# Altium project iot_watch.PrjPcb
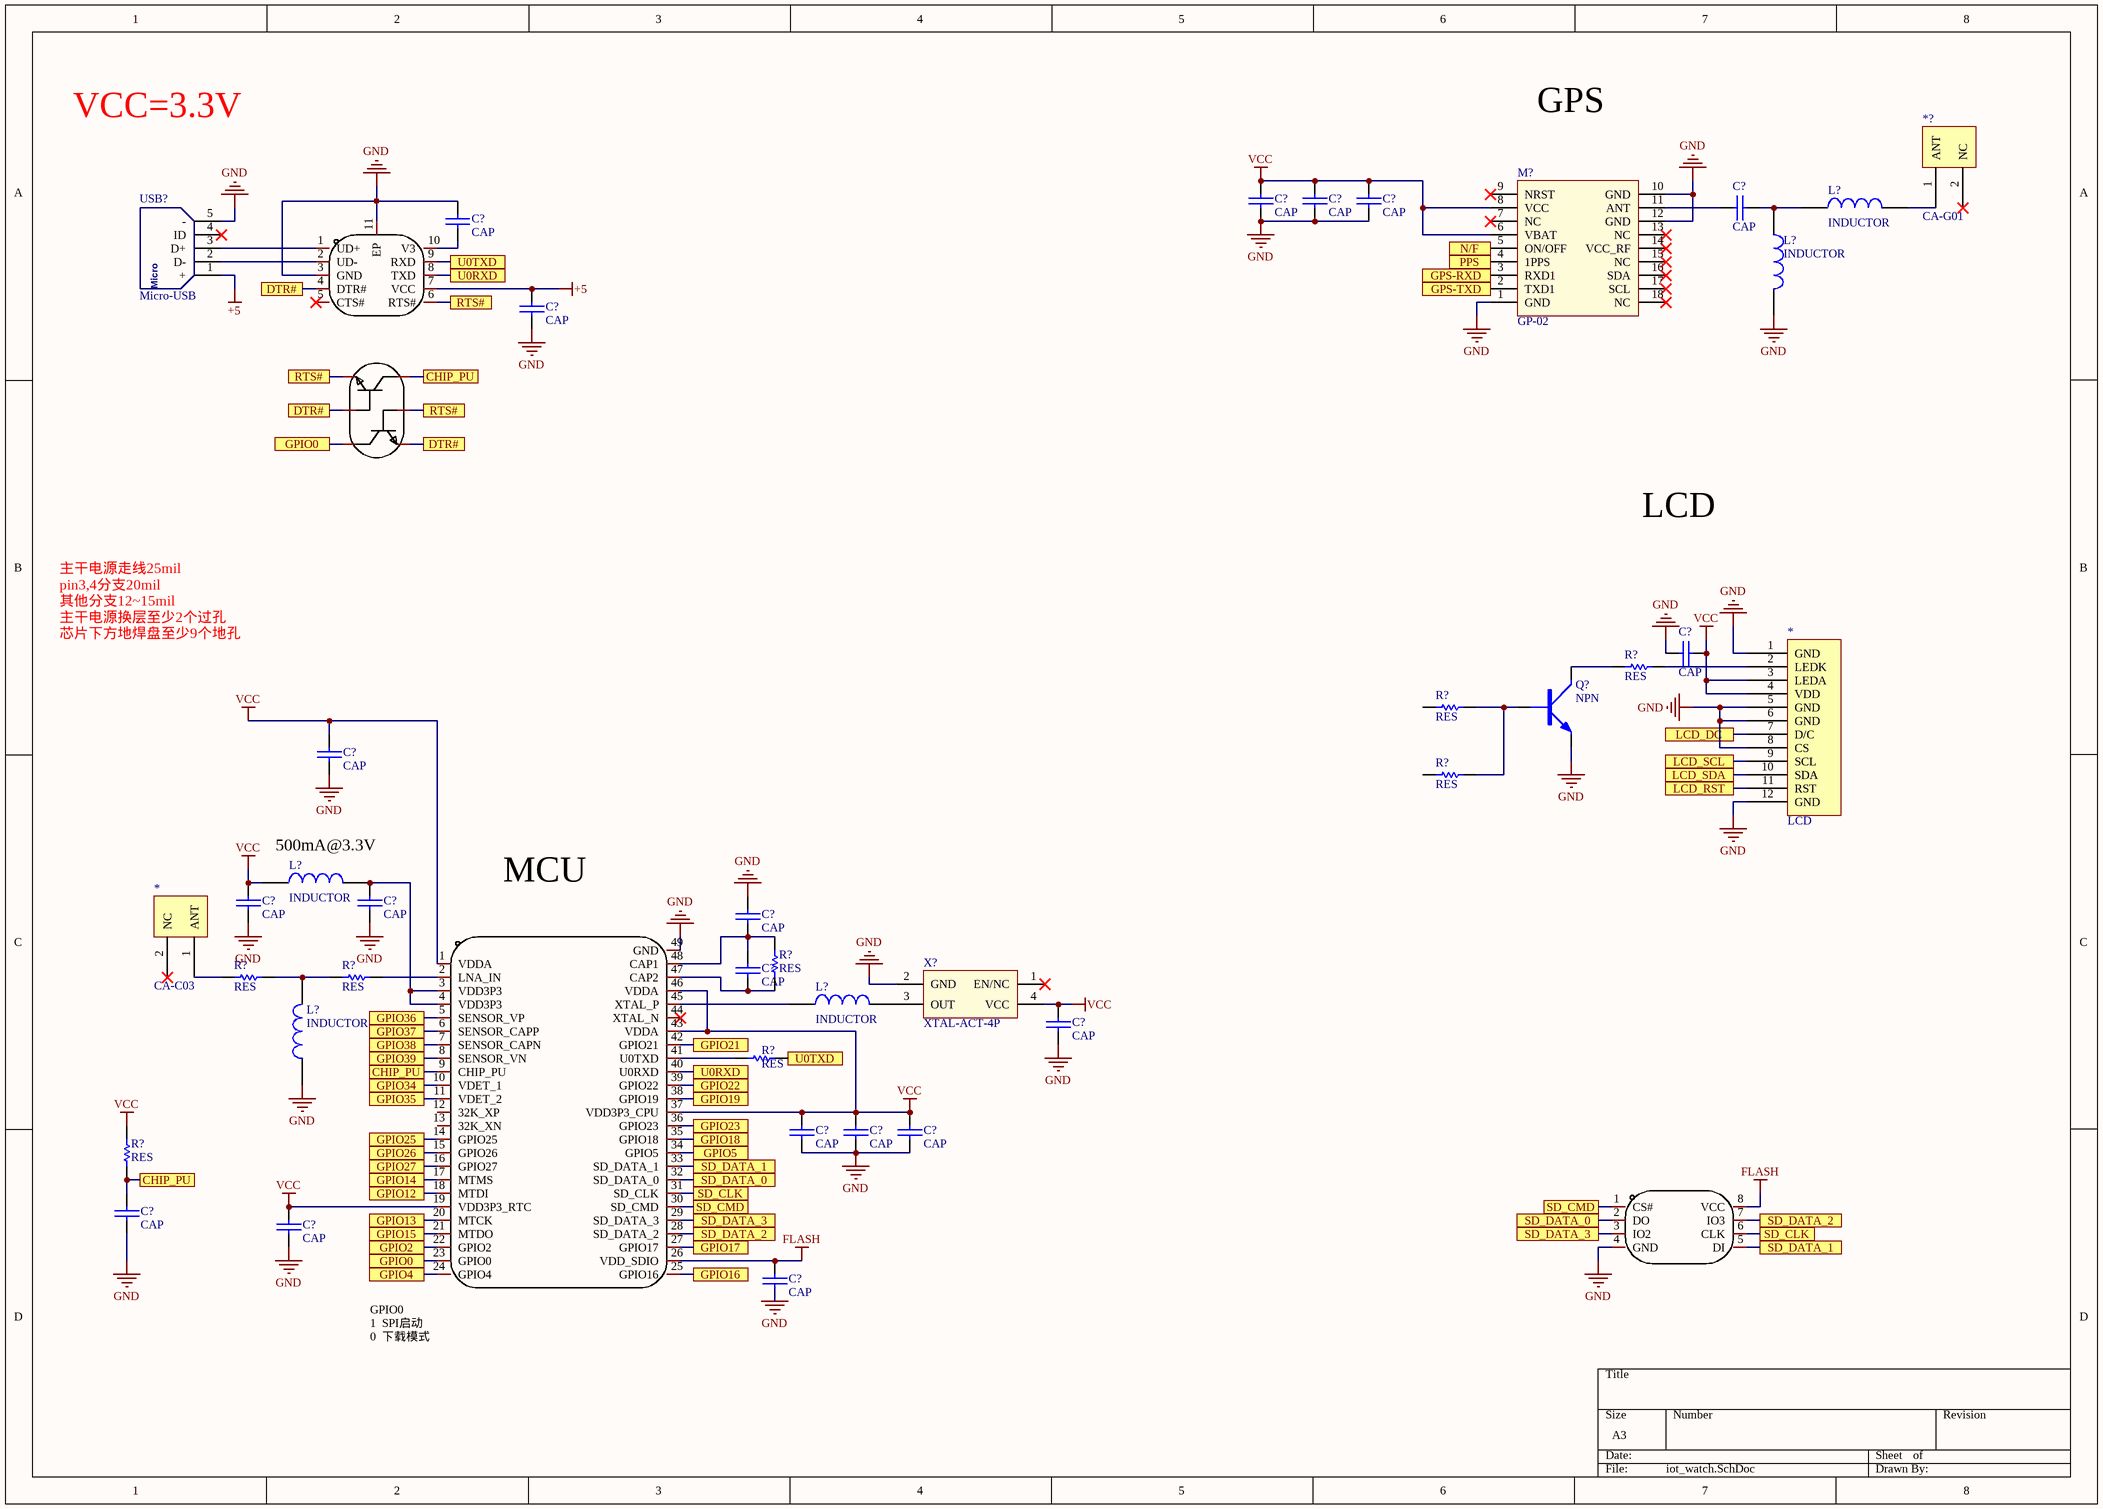
[diagram p0: iot_watch.SchDoc]
1 sheet, 43 parts. Net scope: flat (ports and power ports of the same name join across sheets).
Board file: iot_watch.PcbDoc

## Sheet iot_watch.SchDoc
size A3; SheetNumber: 1; SheetTotal: 1

### Parts
(Parts that share a designator on the sheet are numbered #1, #2 ... from top to bottom, then left to right.)
*#1  LCD  [LCD-FPC-12PIN]
*#2  CA-C03  [CA-C03]
*?  CA-G01  [CA-G01]
C?#1  CAP  [0201C]
C?#2  CAP  [0201C]
C?#3  CAP  [0201C]
C?#4  CAP  [0201C]
C?#5  CAP  [0201C]
C?#6  CAP  [0201C]
C?#7  CAP  [0201C]
C?#8  CAP  [0201C]
C?#9  CAP  [0201C]
C?#10  CAP  [0201C]
C?#11  CAP  [0201C]
C?#12  CAP  [0201C]
C?#13  CAP  [0201C]
C?#14  CAP  [0201C]
C?#15  CAP  [0201C]
C?#16  CAP  [0201C]
C?#17  CAP  [0201C]
C?#18  CAP  [0201C]
C?#19  CAP  [0201C]
L?#1  INDUCTOR  [AL0204]
L?#2  INDUCTOR  [AL0204]
L?#3  INDUCTOR  [AL0204]
L?#4  INDUCTOR  [AL0204]
L?#5  INDUCTOR  [AL0204]
M?  GP-02  [GP-02]
Q?  NPN  [SOT-23]
R?#1  RES  [0201R]
R?#2  RES  [0201R]
R?#3  RES  [0201R]
R?#4  RES  [0201R]
R?#5  RES  [0201R]
R?#6  RES  [0201R]
R?#7  RES  [0201R]
R?#8  RES  [0201R]
U?#1  CH340K  [ESOP-10_L4.9-W3.9-P1.00-LS6.2-BL-EP]  (value not drawn)
U?#2  MMDT3904_C5204740  [SOT-363_L2.1-W1.3-P0.65-LS2.3-BL]  (value not drawn)
U?#3  ESP32-D0WDQ6  [QFN-48_L6.0-W6.0-P0.40-BL-EP3.8]  (value not drawn)
U?#4  W25Q64JVSSIQ_C83140  [SOP-8_L5.3-W5.3-P1.27-LS8.0-BL]  (value not drawn)
USB?  Micro-USB  [USB-MICRO_A]
X?  XTAL-ACT-4P  [OSC 1612-4P]

### Ports
CHIP_PU, DTR#, GPIO0, GPIO2, GPIO4, GPIO5, GPIO12, GPIO13, GPIO14, GPIO15, GPIO16, GPIO17, GPIO18, GPIO19, GPIO21, GPIO22, GPIO23, GPIO25, GPIO26, GPIO27, GPIO34, GPIO35, GPIO36, GPIO37, GPIO38, GPIO39, GPS-RXD, GPS-TXD, LCD_DC, LCD_RST, LCD_SCL, LCD_SDA, N/F, PPS, RTS#, SD_CLK, SD_CMD, SD_DATA_0, SD_DATA_1, SD_DATA_2, SD_DATA_3, U0RXD, U0TXD

### Nets
+5: C?#6.1 U?#1.7(VCC) USB?.1(+)
FLASH: C?#19.2 U?#3.26(VDD_SDIO) U?#4.8(VCC)
GND: *#1.1(GND) *#1.5(GND) *#1.6(GND) *#1.8(CS) *#1.12(GND) C?#1.1 C?#3.1 C?#4.1 C?#5.1 C?#6.2 C?#7.1 C?#8.2 C?#9.1 C?#10.1 C?#11.2 C?#13.1 C?#14.1 C?#15.1 C?#16.1 C?#17.1 C?#18.1 C?#19.1 L?#1.2 L?#5.1 M?.1(GND) M?.10(GND) M?.12(GND) Q?.E U?#1.3(GND) U?#1.11(EP) U?#3.49(GND) U?#4.4(GND) USB?.5(-) X?.2(GND)
VCC: *#1.3(LEDA) *#1.4(VDD) C?#3.2 C?#4.2 C?#5.2 C?#7.2 C?#8.1 C?#9.2 C?#13.2 C?#14.2 C?#15.2 C?#16.2 C?#18.2 L?#3.1 M?.6(VBAT) M?.8(VCC) R?#8.1 U?#3.1(VDDA) U?#3.19(VDD3P3_RTC) U?#3.37(VDD3P3_CPU) U?#3.43(VDDA) U?#3.46(VDDA) X?.4(VCC)
Net*#1_2: *#1.2(LEDK) R?#1.2
Net*#1_7: *#1.7(D/C) ; port LCD_DC
Net*#1_9: *#1.9(SCL) ; port LCD_SCL
Net*#1_10: *#1.10(SDA) ; port LCD_SDA
Net*#1_11: *#1.11(RST) ; port LCD_RST
Net*#2_1: *#2.1(ANT) R?#5.1
Net*?_1: *?.1(ANT) L?#2.2
NetC?#1_2: C?#1.2 U?#1.10(V3)
NetC?#2_1: C?#2.1 L?#1.1 L?#2.1
NetC?#2_2: C?#2.2 M?.11(ANT)
NetC?#10_2: C?#10.2 L?#3.2 U?#3.3(VDD3P3) U?#3.4(VDD3P3)
NetC?#11_1: C?#11.1 C?#12.2 R?#4.1 U?#3.48(CAP1)
NetC?#12_1: C?#12.1 R?#4.2 U?#3.47(CAP2)
NetC?#17_2: C?#17.2 R?#8.2 U?#2.3(C) U?#3.9(CHIP_PU) ; port CHIP_PU
NetL?#4_1: L?#4.1 U?#3.45(XTAL_P)
NetL?#4_2: L?#4.2 X?.3(OUT)
NetL?#5_2: L?#5.2 R?#5.2 R?#6.1
NetM?_2: M?.2(TXD1) ; port GPS-TXD
NetM?_3: M?.3(RXD1) ; port GPS-RXD
NetM?_4: M?.4(1PPS) ; port PPS
NetM?_5: M?.5(ON/OFF) ; port N/F
NetQ?_B: Q?.B R?#2.2 R?#3.2
NetQ?_C: Q?.C R?#1.1
NetR?#6_2: R?#6.2 U?#3.2(LNA_IN)
NetR?#7_1: R?#7.1 U?#3.41(U0TXD)
NetR?#7_2: R?#7.2 U?#1.9(RXD) ; port U0TXD
NetU?#1_1: U?#1.1(UD+) USB?.3(D+)
NetU?#1_2: U?#1.2(UD-) USB?.2(D-)
NetU?#1_4: U?#1.4(DTR#) U?#2.1(E) U?#2.5(B) ; port DTR#
NetU?#1_6: U?#1.6(RTS#) U?#2.2(B) U?#2.4(E) ; port RTS#
NetU?#1_8: U?#1.8(TXD) U?#3.40(U0RXD) ; port U0RXD
NetU?#2_6: U?#2.6(C) U?#3.23(GPIO0) ; port GPIO0
NetU?#3_5: U?#3.5(SENSOR_VP) ; port GPIO36
NetU?#3_6: U?#3.6(SENSOR_CAPP) ; port GPIO37
NetU?#3_7: U?#3.7(SENSOR_CAPN) ; port GPIO38
NetU?#3_8: U?#3.8(SENSOR_VN) ; port GPIO39
NetU?#3_10: U?#3.10(VDET_1) ; port GPIO34
NetU?#3_11: U?#3.11(VDET_2) ; port GPIO35
NetU?#3_14: U?#3.14(GPIO25) ; port GPIO25
NetU?#3_15: U?#3.15(GPIO26) ; port GPIO26
NetU?#3_16: U?#3.16(GPIO27) ; port GPIO27
NetU?#3_17: U?#3.17(MTMS) ; port GPIO14
NetU?#3_18: U?#3.18(MTDI) ; port GPIO12
NetU?#3_20: U?#3.20(MTCK) ; port GPIO13
NetU?#3_21: U?#3.21(MTDO) ; port GPIO15
NetU?#3_22: U?#3.22(GPIO2) ; port GPIO2
NetU?#3_24: U?#3.24(GPIO4) ; port GPIO4
NetU?#3_25: U?#3.25(GPIO16) ; port GPIO16
NetU?#3_27: U?#3.27(GPIO17) ; port GPIO17
NetU?#3_28: U?#3.28(SD_DATA_2) U?#4.7(IO3) ; port SD_DATA_2
NetU?#3_29: U?#3.29(SD_DATA_3) U?#4.3(IO2) ; port SD_DATA_3
NetU?#3_30: U?#3.30(SD_CMD) U?#4.1(CS#) ; port SD_CMD
NetU?#3_31: U?#3.31(SD_CLK) U?#4.6(CLK) ; port SD_CLK
NetU?#3_32: U?#3.32(SD_DATA_0) U?#4.2(DO) ; port SD_DATA_0
NetU?#3_33: U?#3.33(SD_DATA_1) U?#4.5(DI) ; port SD_DATA_1
NetU?#3_34: U?#3.34(GPIO5) ; port GPIO5
NetU?#3_35: U?#3.35(GPIO18) ; port GPIO18
NetU?#3_36: U?#3.36(GPIO23) ; port GPIO23
NetU?#3_38: U?#3.38(GPIO19) ; port GPIO19
NetU?#3_39: U?#3.39(GPIO22) ; port GPIO22
NetU?#3_42: U?#3.42(GPIO21) ; port GPIO21

Not connected (* = marked no-connect by the designer): *#2 2(NC)*; *? 2(NC)*; M? 7(NC)* 9(NRST)* 13(NC)* 14(VCC_RF)* 15(NC)* 16(SDA)* 17(SCL)* 18(NC)*; R?#2 1; R?#3 1; U?#1 5(CTS#)*; U?#3 12(32K_XP) 13(32K_XN) 44(XTAL_N)*; USB? 4(ID)*; X? 1(EN/NC)*

### Notes on the sheet
- GPS
- VCC=3.3V
- LCD
- 主干电源走线25mil
  pin3,4分支20mil
  其他分支12~15mil
  主干电源换层至少2个过孔
  芯片下方地焊盘至少9个地孔
- 500mA@3.3V
- MCU
- (near U?#3) GPIO0
  1  SPI启动
  0  下载模式
- (in symbol Micro-USB) Micro

### Library data of the parts
C?#1-C?#19 = CAP: 无极性电容
Q? = NPN: NPN三极管
U?#1 = CH340K: Manufacturer: WCH(南京沁恒); Add into BOM: yes; Name: CH340K; Symbol: CH340K; Device: CH340K; LCSC Part Name: CH340K; Supplier Part: C968586; Manufacturer Part: CH340K; Supplier Footprint: ESOP-10-EP-150mil; JLCPCB Part Class: Extended Part; Datasheet: https://atta.szlcsc.com/upload/public/pdf/source/20200819/C84681_ADBED554CE321879DBD6B1D06488689C.pdf; Supplier: LCSC; Convert to PCB: yes; Applications Function: -; Protocol: -
U?#2 = MMDT3904_C5204740: Manufacturer: TWGMC(台湾迪嘉); Add into BOM: yes; Name: MMDT3904; Symbol: MMDT3904_C5204740; Device: MMDT3904_C5204740; LCSC Part Name: MMDT3904; Supplier Part: C5204740; Manufacturer Part: MMDT3904; Supplier Footprint: SOT-363; JLCPCB Part Class: Extended Part; Datasheet: https://atta.szlcsc.com/upload/public/pdf/source/20221019/5C73A5BE2176C860B0C75E749853D8F2.pdf; Supplier: LCSC; Convert to PCB: yes
U?#3 = ESP32-D0WDQ6: Manufacturer: ESPRESSIF(乐鑫); Add into BOM: yes; Name: ESP32-D0WDQ6; Symbol: ESP32-D0WDQ6; Device: ESP32-D0WDQ6; LCSC Part Name: ESP32-D0WDQ6; Supplier Part: C129733; Manufacturer Part: ESP32-D0WDQ6; Supplier Footprint: QFN-48-EP(6x6); JLCPCB Part Class: Extended Part; Datasheet: https://atta.szlcsc.com/upload/public/pdf/source/20180207/C129733_15179947908541359020.pdf; Supplier: LCSC; Convert to PCB: yes
U?#4 = W25Q64JVSSIQ_C83140: Manufacturer: WINBOND(华邦); Add into BOM: yes; Name: W25Q64JVSSIQ; Symbol: W25Q64JVSSIQ; Device: W25Q64JVSSIQ_C83140; LCSC Part Name: W25Q64JVSSIQ; Supplier Part: C83140; Manufacturer Part: W25Q64JVSSIQ; Supplier Footprint: SOP-8-208mil; JLCPCB Part Class: Extended Part; Datasheet: https://atta.szlcsc.com/upload/public/pdf/source/20161110/1478742546019.pdf; Supplier: LCSC; Convert to PCB: yes
X? = XTAL-ACT-4P: 4脚有源晶振